# EAGLE design Voltage monitor (EAGLE 9.6.2)
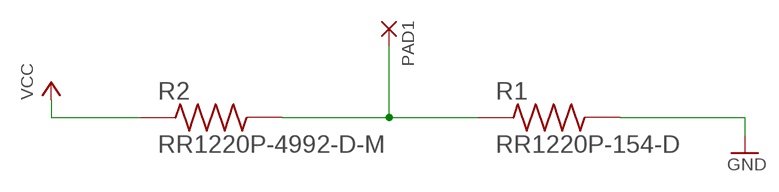
[diagram p0: schematic, sheet 1]

## Parts
PAD1  SMD2  [SMD1,27-2,54]
R1  RR1220P-154-D  [RESC2012X50N]
R2  RR1220P-4992-D-M  [RESC2012X50N]

## Nets
GND: R1.2
N$1: PAD1.1(P) R1.1 R2.2
VCC: R2.1

## Library data of the parts
PAD1 = wirepad:SMD2: SMD PAD
R1 = RR1220P-154-D:RR1220P-154-D: RES, THIN FILM, 150K, 0.5%, 0.1W, 0805
R2 = RR1220P-4992-D-M:RR1220P-4992-D-M: RESISTOR, THIN FILM, 49.9KOHM, 100mW 0.5; RESISTOR, THIN FILM, 49.9KOHM, 100mW 0.5%; Resistance:49.9kohm; Resistance Tolerance:± 0.5%; Power Rating:100mW; Voltage Rating:100V; Temperature Coefficient:± 25ppm/°C; Resistor Element Material:Thin Film

## Board
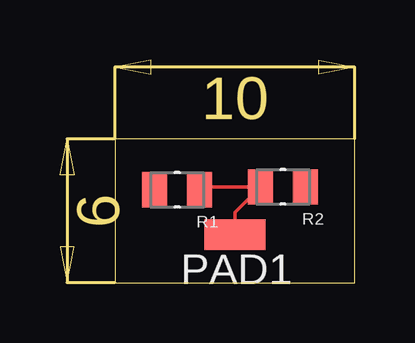
[diagram p1: board, top side]

Size 10 x 6 mm. Coordinates in mm from the lower left corner, seen from the top.
Outline: 0,0 10,0 10,6 0,6 0,0
Copper layers (1*16): Top 0.035mm / dielectric 1.5mm / Bottom 0.035mm
Design rules "default": minimum track width 6mil, minimum drill 0.35mm, track to track 6mil, track to pad 6mil, pad to pad 6mil, via to via 6mil, smd to smd 6mil, copper to edge 40mil, drill to drill 6mil, minimum pad ring 10mil, minimum via ring 8mil, stop-mask expansion 4mil, vias tented up to drill 0mil, thermal gap 10mil

### Footprints (pad centres in the part's own frame; a part is rotated, then mirrored left to right if it is on the bottom)
SMD1,27-2,54 = smd 1.27 x 2.54: 1 0,0
RESC2012X50N = smd 1.04 x 1.47: 1 -0.94,0; 2 0.94,0

### Placement (x,y rotation side)
PAD1  5,2 90 top
R1  2.59,3.88 180 top
R2  7,4 180 top

### Tracks (layer width: path | path; a pad name or v marks a point on that pad's centre or on a via)
N$1
  Top 0.152: R1.1 3.65,4 R2.2 5,2.94 PAD1.1